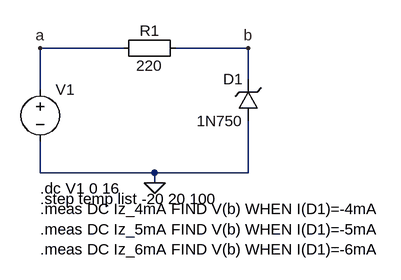
[diagram p0: schematic Z-VA-LV.asc]
Z-VA-LV.asc, the LTspice schematic file:
Version 4
SHEET 1 880 680
WIRE 96 -288 -32 -288
WIRE 288 -288 176 -288
WIRE 288 -240 288 -288
WIRE -32 -224 -32 -288
WIRE -32 -96 -32 -144
WIRE 144 -96 -32 -96
WIRE 288 -96 288 -176
WIRE 288 -96 144 -96
WIRE 144 -80 144 -96
FLAG 144 -80 0
FLAG 288 -288 b
FLAG -32 -288 a
SYMBOL Misc\\EuropeanResistor 192 -304 R90
WINDOW 0 5 56 VBottom 2
WINDOW 3 27 56 VTop 2
SYMATTR InstName R1
SYMATTR Value 220
SYMBOL zener 304 -176 R180
WINDOW 0 24 64 Left 2
WINDOW 3 24 0 Left 2
SYMATTR InstName D1
SYMATTR Value 1N750
SYMBOL voltage -32 -240 R0
SYMATTR InstName V1
SYMATTR Value ""
TEXT -32 -72 Left 2 !.dc V1 0 16
TEXT -32 -56 Left 2 !.step temp list -20 20 100
TEXT -32 -40 Left 2 !.meas DC Iz_4mA FIND V(b) WHEN I(D1)=-4mA\n.meas DC Iz_5mA FIND V(b) WHEN I(D1)=-5mA\n.meas DC Iz_6mA FIND V(b) WHEN I(D1)=-6mA

The netlist it stands for:
* Z-VA-LV.asc
R1 b a 220
D1 0 b 1N750
V1 a 0
.model D D
.lib standard.dio
.dc V1 0 16
.step temp list -20 20 100
.meas DC Iz_4mA FIND V(b) WHEN I(D1)=-4mA
.meas DC Iz_5mA FIND V(b) WHEN I(D1)=-5mA
.meas DC Iz_6mA FIND V(b) WHEN I(D1)=-6mA
.backanno
.end